# Altium schematic sheet main.SchDoc
size D; Organization: Altium Limited; Address1: 3 Minna Close; Address2: Belrose; Address3: NSW 2085; Address4: Australia
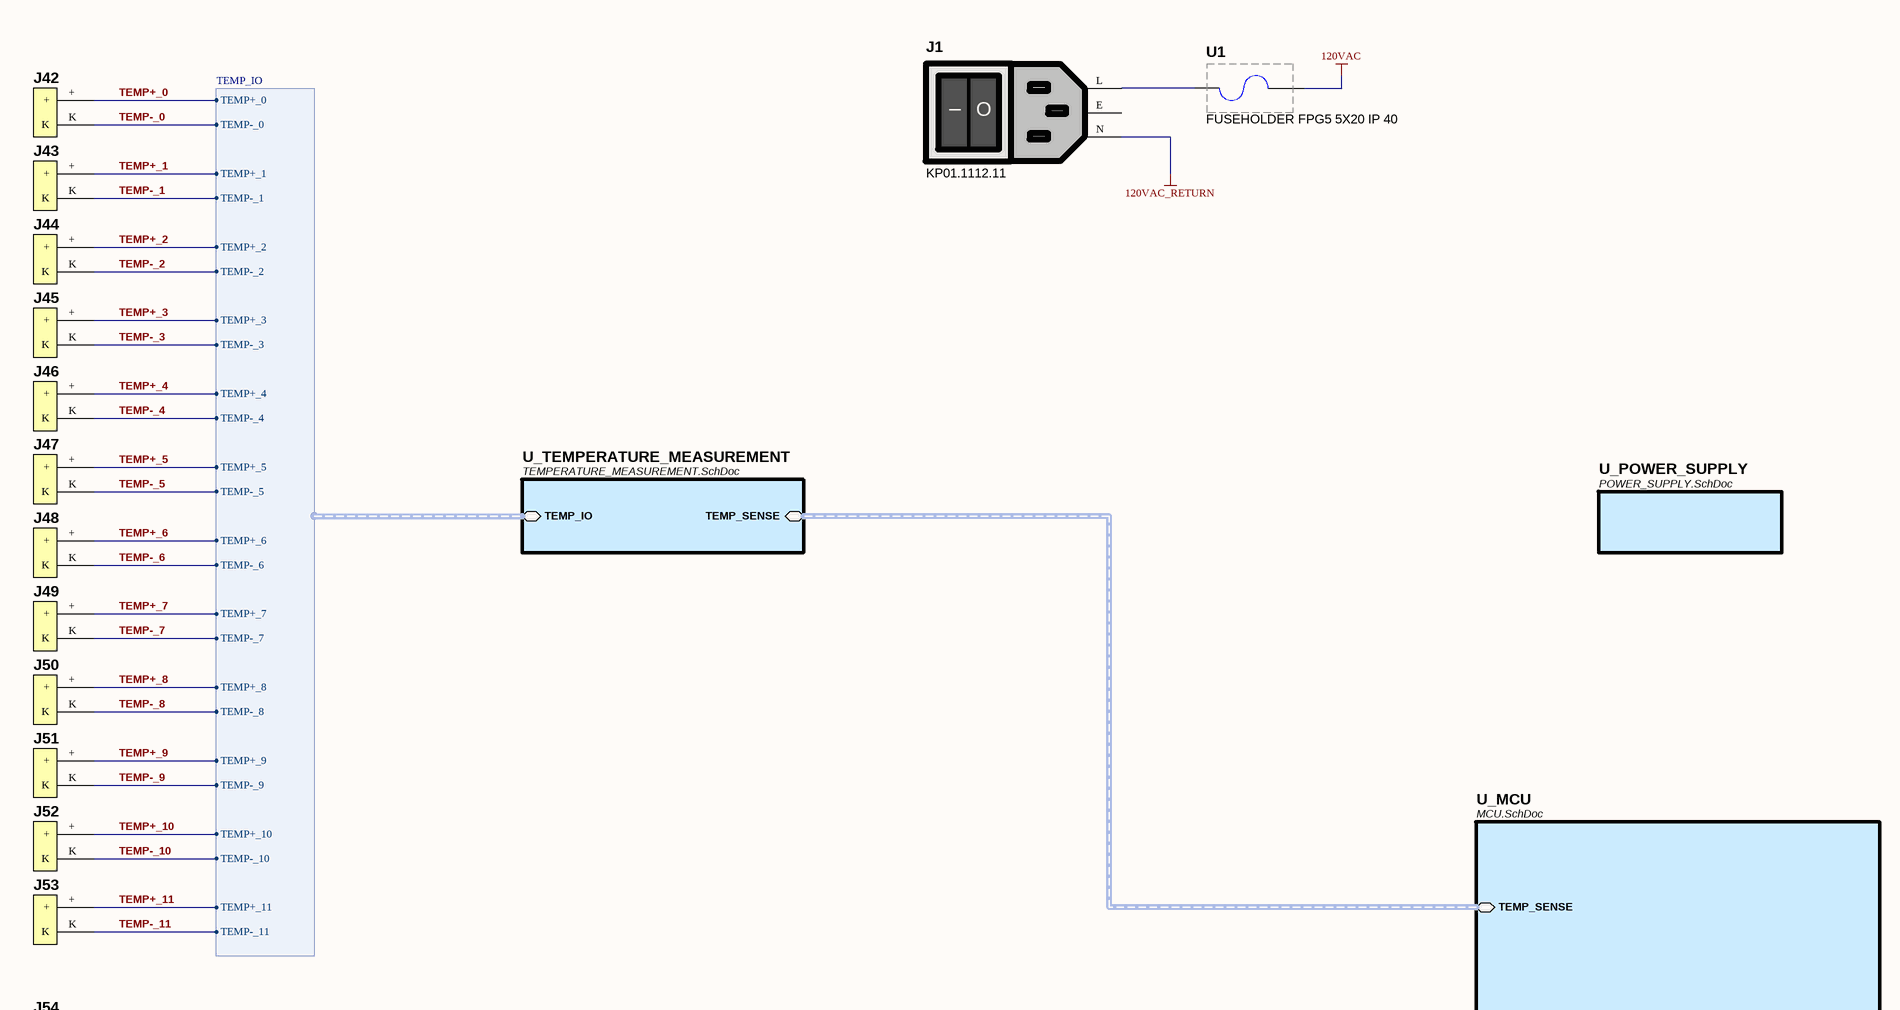
[diagram p0: main.SchDoc, top left]
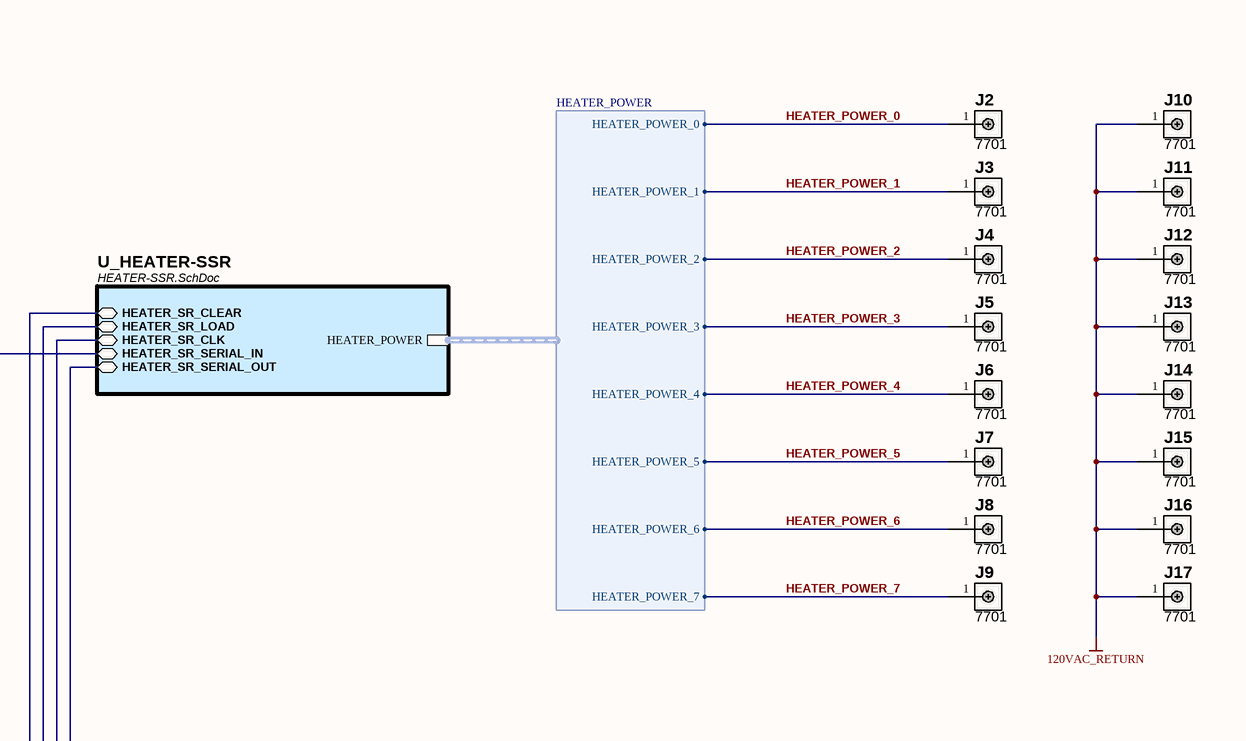
[diagram p1: main.SchDoc, top right]
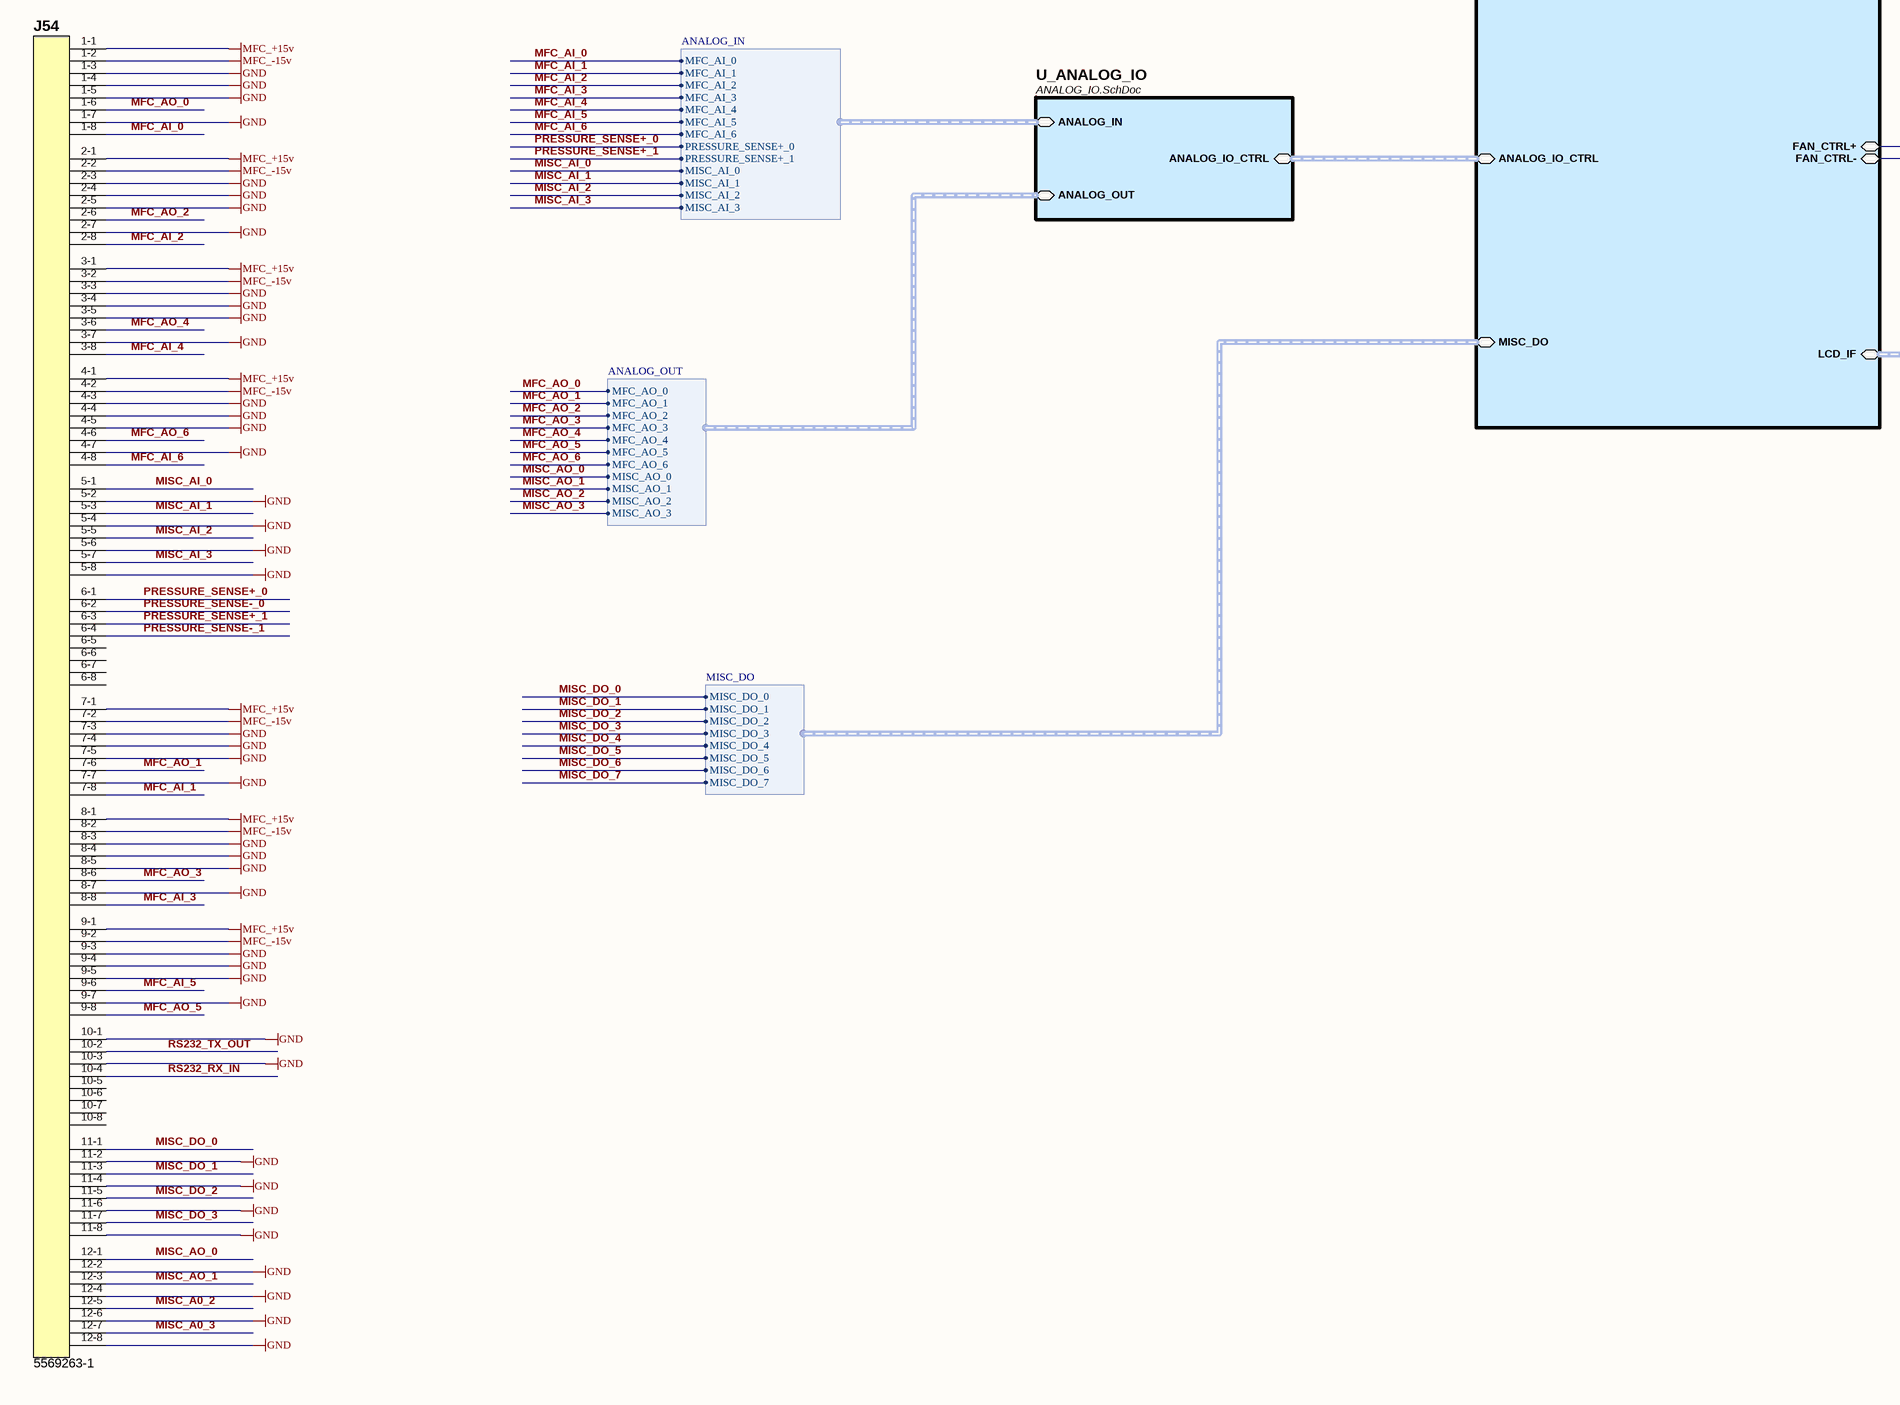
[diagram p2: main.SchDoc, bottom left]
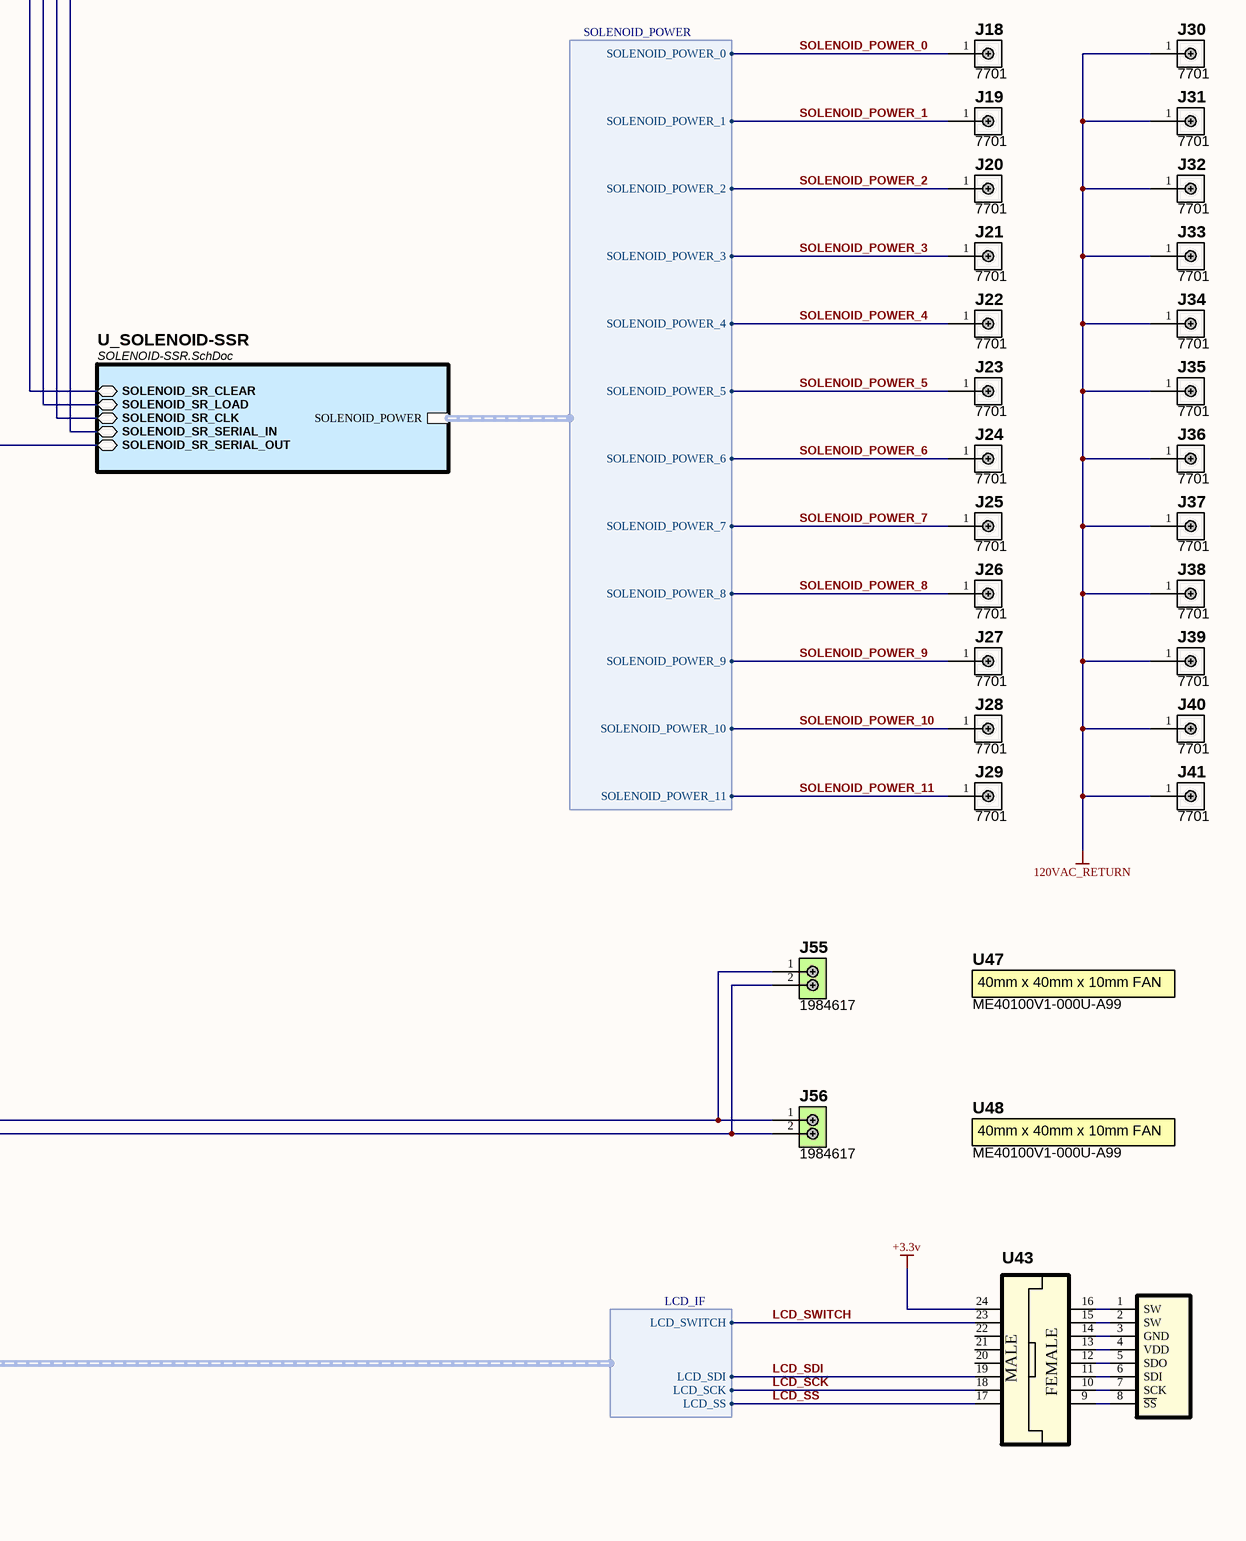
[diagram p3: main.SchDoc, bottom right]

## Parts
J1  KP01.1112.11  [KP01.1112.11]
J2  7701  [7701]
J3  7701  [7701]
J4  7701  [7701]
J5  7701  [7701]
J6  7701  [7701]
J7  7701  [7701]
J8  7701  [7701]
J9  7701  [7701]
J10  7701  [7701]
J11  7701  [7701]
J12  7701  [7701]
J13  7701  [7701]
J14  7701  [7701]
J15  7701  [7701]
J16  7701  [7701]
J17  7701  [7701]
J18  7701  [7701]
J19  7701  [7701]
J20  7701  [7701]
J21  7701  [7701]
J22  7701  [7701]
J23  7701  [7701]
J24  7701  [7701]
J25  7701  [7701]
J26  7701  [7701]
J27  7701  [7701]
J28  7701  [7701]
J29  7701  [7701]
J30  7701  [7701]
J31  7701  [7701]
J32  7701  [7701]
J33  7701  [7701]
J34  7701  [7701]
J35  7701  [7701]
J36  7701  [7701]
J37  7701  [7701]
J38  7701  [7701]
J39  7701  [7701]
J40  7701  [7701]
J41  7701  [7701]
J42  PCC-SMP-K  [PCC-SMP-V]  (value not drawn)
J43  PCC-SMP-K  [PCC-SMP-V]  (value not drawn)
J44  PCC-SMP-K  [PCC-SMP-V]  (value not drawn)
J45  PCC-SMP-K  [PCC-SMP-V]  (value not drawn)
J46  PCC-SMP-K  [PCC-SMP-V]  (value not drawn)
J47  PCC-SMP-K  [PCC-SMP-V]  (value not drawn)
J48  PCC-SMP-K  [PCC-SMP-V]  (value not drawn)
J49  PCC-SMP-K  [PCC-SMP-V]  (value not drawn)
J50  PCC-SMP-K  [PCC-SMP-V]  (value not drawn)
J51  PCC-SMP-K  [PCC-SMP-V]  (value not drawn)
J52  PCC-SMP-K  [PCC-SMP-V]  (value not drawn)
J53  PCC-SMP-K  [PCC-SMP-V]  (value not drawn)
J54  5569263-1  [5569263-1]
J55  1984617  [1984617]
J56  1984617  [1984617]
U1  FUSEHOLDER FPG5 5X20 IP 40  [3101.0055]
U43  IS15DSBFP4RGB  [R/A IS15DSBFP4RGB]  (value not drawn)
U47  ME40100V1-000U-A99  [ME40100V1-000U-A99]
U48  ME40100V1-000U-A99  [ME40100V1-000U-A99]

## Sub-sheets
U_ANALOG_IO = ANALOG_IO.SchDoc: ANALOG_IN (harness ANALOG_IN), ANALOG_OUT (harness ANALOG_OUT), ANALOG_IO_CTRL (harness ANALOG_IO_CTRL)
U_HEATER-SSR = HEATER-SSR.SchDoc: HEATER_POWER (harness HEATER_POWER), HEATER_SR_CLEAR, HEATER_SR_LOAD, HEATER_SR_CLK, HEATER_SR_SERIAL_IN, HEATER_SR_SERIAL_OUT
U_MCU = MCU.SchDoc: ANALOG_IO_CTRL (harness ANALOG_IO_CTRL), TEMP_SENSE (harness TEMP_SENSE), LCD_IF (harness LCD_IF), FAN_CTRL+, FAN_CTRL-, MISC_DO (harness MISC_DO)
U_POWER_SUPPLY = POWER_SUPPLY.SchDoc: no entries
U_SOLENOID-SSR = SOLENOID-SSR.SchDoc: SOLENOID_POWER (harness SOLENOID_POWER), SOLENOID_SR_CLEAR, SOLENOID_SR_LOAD, SOLENOID_SR_CLK, SOLENOID_SR_SERIAL_IN, SOLENOID_SR_SERIAL_OUT
U_TEMPERATURE_MEASUREMENT = TEMPERATURE_MEASUREMENT.SchDoc: TEMP_IO (harness TEMP_IO), TEMP_SENSE (harness TEMP_SENSE)

## Harnesses
HEATER_POWER: HEATER_POWER_0, HEATER_POWER_1, HEATER_POWER_2, HEATER_POWER_3, HEATER_POWER_4, HEATER_POWER_5, HEATER_POWER_6, HEATER_POWER_7
SOLENOID_POWER: SOLENOID_POWER_0, SOLENOID_POWER_1, SOLENOID_POWER_2, SOLENOID_POWER_3, SOLENOID_POWER_4, SOLENOID_POWER_5, SOLENOID_POWER_6, SOLENOID_POWER_7, SOLENOID_POWER_8, SOLENOID_POWER_9, SOLENOID_POWER_10, SOLENOID_POWER_11
TEMP_IO: TEMP-_0, TEMP+_0, TEMP+_1, TEMP-_1, TEMP+_2, TEMP-_2, TEMP+_3, TEMP-_3, TEMP+_4, TEMP-_4, TEMP+_5, TEMP-_5, TEMP+_6, TEMP-_6, TEMP+_7, TEMP-_7, TEMP+_8, TEMP-_8, TEMP+_9, TEMP-_9, TEMP+_10, TEMP-_10, TEMP+_11, TEMP-_11
ANALOG_OUT: MFC_AO_0, MFC_AO_1, MFC_AO_2, MFC_AO_3, MFC_AO_4, MFC_AO_5, MFC_AO_6, MISC_AO_0, MISC_AO_1, MISC_AO_2, MISC_AO_3
ANALOG_IN: MFC_AI_0, MFC_AI_1, MFC_AI_2, MFC_AI_3, MFC_AI_4, MFC_AI_5, MFC_AI_6, PRESSURE_SENSE+_0, PRESSURE_SENSE+_1, MISC_AI_0, MISC_AI_1, MISC_AI_2, MISC_AI_3
LCD_IF: LCD_SWITCH, LCD_SDI, LCD_SCK, LCD_SS
MISC_DO: MISC_DO_0, MISC_DO_1, MISC_DO_2, MISC_DO_3, MISC_DO_4, MISC_DO_5, MISC_DO_6, MISC_DO_7

## Nets
120VAC: U1.2
120VAC_RETURN: J1.N J10.1 J11.1 J12.1 J13.1 J14.1 J15.1 J16.1 J17.1 J30.1 J31.1 J32.1 J33.1 J34.1 J35.1 J36.1 J37.1 J38.1 J39.1 J40.1 J41.1
+3.3v: U43.24
GND: J54.1-3 J54.1-4 J54.1-5 J54.1-7 J54.2-3 J54.2-4 J54.2-5 J54.2-7 J54.3-3 J54.3-4 J54.3-5 J54.3-7 J54.4-3 J54.4-4 J54.4-5 J54.4-7 J54.5-2 J54.5-4 J54.5-6 J54.5-8 J54.7-3 J54.7-4 J54.7-5 J54.7-7 J54.8-3 J54.8-4 J54.8-5 J54.8-7 J54.9-3 J54.9-4 J54.9-5 J54.9-7 J54.10-1 J54.10-3 J54.11-2 J54.11-4 J54.11-6 J54.11-8 J54.12-2 J54.12-4 J54.12-6 J54.12-8
MFC_+15v: J54.1-1 J54.2-1 J54.3-1 J54.4-1 J54.7-1 J54.8-1 J54.9-1
MFC_-15v: J54.1-2 J54.2-2 J54.3-2 J54.4-2 J54.7-2 J54.8-2 J54.9-2
HEATER_POWER_0: J2.1 ; sheet U_HEATER-SSR/HEATER_POWER.HEATER_POWER_0
HEATER_POWER_1: J3.1 ; sheet U_HEATER-SSR/HEATER_POWER.HEATER_POWER_1
HEATER_POWER_2: J4.1 ; sheet U_HEATER-SSR/HEATER_POWER.HEATER_POWER_2
HEATER_POWER_3: J5.1 ; sheet U_HEATER-SSR/HEATER_POWER.HEATER_POWER_3
HEATER_POWER_4: J6.1 ; sheet U_HEATER-SSR/HEATER_POWER.HEATER_POWER_4
HEATER_POWER_5: J7.1 ; sheet U_HEATER-SSR/HEATER_POWER.HEATER_POWER_5
HEATER_POWER_6: J8.1 ; sheet U_HEATER-SSR/HEATER_POWER.HEATER_POWER_6
HEATER_POWER_7: J9.1 ; sheet U_HEATER-SSR/HEATER_POWER.HEATER_POWER_7
LCD_SCK: U43.18 ; sheet U_MCU/LCD_IF.LCD_SCK
LCD_SDI: U43.19 ; sheet U_MCU/LCD_IF.LCD_SDI
LCD_SS: U43.17 ; sheet U_MCU/LCD_IF.LCD_SS
LCD_SWITCH: U43.23 ; sheet U_MCU/LCD_IF.LCD_SWITCH
MFC_AI_0: J54.1-8 ; sheet U_ANALOG_IO/ANALOG_IN.MFC_AI_0
MFC_AI_1: J54.7-8 ; sheet U_ANALOG_IO/ANALOG_IN.MFC_AI_1
MFC_AI_2: J54.2-8 ; sheet U_ANALOG_IO/ANALOG_IN.MFC_AI_2
MFC_AI_3: J54.8-8 ; sheet U_ANALOG_IO/ANALOG_IN.MFC_AI_3
MFC_AI_4: J54.3-8 ; sheet U_ANALOG_IO/ANALOG_IN.MFC_AI_4
MFC_AI_5: J54.9-6 ; sheet U_ANALOG_IO/ANALOG_IN.MFC_AI_5
MFC_AI_6: J54.4-8 ; sheet U_ANALOG_IO/ANALOG_IN.MFC_AI_6
MFC_AO_0: J54.1-6 ; sheet U_ANALOG_IO/ANALOG_OUT.MFC_AO_0
MFC_AO_1: J54.7-6 ; sheet U_ANALOG_IO/ANALOG_OUT.MFC_AO_1
MFC_AO_2: J54.2-6 ; sheet U_ANALOG_IO/ANALOG_OUT.MFC_AO_2
MFC_AO_3: J54.8-6 ; sheet U_ANALOG_IO/ANALOG_OUT.MFC_AO_3
MFC_AO_4: J54.3-6 ; sheet U_ANALOG_IO/ANALOG_OUT.MFC_AO_4
MFC_AO_5: J54.9-8 ; sheet U_ANALOG_IO/ANALOG_OUT.MFC_AO_5
MFC_AO_6: J54.4-6 ; sheet U_ANALOG_IO/ANALOG_OUT.MFC_AO_6
MISC_A0_2: J54.12-5
MISC_A0_3: J54.12-7
MISC_AI_0: J54.5-1 ; sheet U_ANALOG_IO/ANALOG_IN.MISC_AI_0
MISC_AI_1: J54.5-3 ; sheet U_ANALOG_IO/ANALOG_IN.MISC_AI_1
MISC_AI_2: J54.5-5 ; sheet U_ANALOG_IO/ANALOG_IN.MISC_AI_2
MISC_AI_3: J54.5-7 ; sheet U_ANALOG_IO/ANALOG_IN.MISC_AI_3
MISC_AO_0: J54.12-1 ; sheet U_ANALOG_IO/ANALOG_OUT.MISC_AO_0
MISC_AO_1: J54.12-3 ; sheet U_ANALOG_IO/ANALOG_OUT.MISC_AO_1
MISC_AO_2: sheet U_ANALOG_IO/ANALOG_OUT.MISC_AO_2
MISC_AO_3: sheet U_ANALOG_IO/ANALOG_OUT.MISC_AO_3
MISC_DO_0: J54.11-1 ; sheet U_MCU/MISC_DO.MISC_DO_0
MISC_DO_1: J54.11-3 ; sheet U_MCU/MISC_DO.MISC_DO_1
MISC_DO_2: J54.11-5 ; sheet U_MCU/MISC_DO.MISC_DO_2
MISC_DO_3: J54.11-7 ; sheet U_MCU/MISC_DO.MISC_DO_3
MISC_DO_4: sheet U_MCU/MISC_DO.MISC_DO_4
MISC_DO_5: sheet U_MCU/MISC_DO.MISC_DO_5
MISC_DO_6: sheet U_MCU/MISC_DO.MISC_DO_6
MISC_DO_7: sheet U_MCU/MISC_DO.MISC_DO_7
PRESSURE_SENSE+_0: J54.6-1 ; sheet U_ANALOG_IO/ANALOG_IN.PRESSURE_SENSE+_0
PRESSURE_SENSE+_1: J54.6-3 ; sheet U_ANALOG_IO/ANALOG_IN.PRESSURE_SENSE+_1
PRESSURE_SENSE-_0: J54.6-2
PRESSURE_SENSE-_1: J54.6-4
RS232_RX_IN: J54.10-4
RS232_TX_OUT: J54.10-2
SOLENOID_POWER_0: J18.1 ; sheet U_SOLENOID-SSR/SOLENOID_POWER.SOLENOID_POWER_0
SOLENOID_POWER_1: J19.1 ; sheet U_SOLENOID-SSR/SOLENOID_POWER.SOLENOID_POWER_1
SOLENOID_POWER_2: J20.1 ; sheet U_SOLENOID-SSR/SOLENOID_POWER.SOLENOID_POWER_2
SOLENOID_POWER_3: J21.1 ; sheet U_SOLENOID-SSR/SOLENOID_POWER.SOLENOID_POWER_3
SOLENOID_POWER_4: J22.1 ; sheet U_SOLENOID-SSR/SOLENOID_POWER.SOLENOID_POWER_4
SOLENOID_POWER_5: J23.1 ; sheet U_SOLENOID-SSR/SOLENOID_POWER.SOLENOID_POWER_5
SOLENOID_POWER_6: J24.1 ; sheet U_SOLENOID-SSR/SOLENOID_POWER.SOLENOID_POWER_6
SOLENOID_POWER_7: J25.1 ; sheet U_SOLENOID-SSR/SOLENOID_POWER.SOLENOID_POWER_7
SOLENOID_POWER_8: J26.1 ; sheet U_SOLENOID-SSR/SOLENOID_POWER.SOLENOID_POWER_8
SOLENOID_POWER_9: J27.1 ; sheet U_SOLENOID-SSR/SOLENOID_POWER.SOLENOID_POWER_9
SOLENOID_POWER_10: J28.1 ; sheet U_SOLENOID-SSR/SOLENOID_POWER.SOLENOID_POWER_10
SOLENOID_POWER_11: J29.1 ; sheet U_SOLENOID-SSR/SOLENOID_POWER.SOLENOID_POWER_11
TEMP+_0: J42.+ ; sheet U_TEMPERATURE_MEASUREMENT/TEMP_IO.TEMP+_0
TEMP+_1: J43.+ ; sheet U_TEMPERATURE_MEASUREMENT/TEMP_IO.TEMP+_1
TEMP+_2: J44.+ ; sheet U_TEMPERATURE_MEASUREMENT/TEMP_IO.TEMP+_2
TEMP+_3: J45.+ ; sheet U_TEMPERATURE_MEASUREMENT/TEMP_IO.TEMP+_3
TEMP+_4: J46.+ ; sheet U_TEMPERATURE_MEASUREMENT/TEMP_IO.TEMP+_4
TEMP+_5: J47.+ ; sheet U_TEMPERATURE_MEASUREMENT/TEMP_IO.TEMP+_5
TEMP+_6: J48.+ ; sheet U_TEMPERATURE_MEASUREMENT/TEMP_IO.TEMP+_6
TEMP+_7: J49.+ ; sheet U_TEMPERATURE_MEASUREMENT/TEMP_IO.TEMP+_7
TEMP+_8: J50.+ ; sheet U_TEMPERATURE_MEASUREMENT/TEMP_IO.TEMP+_8
TEMP+_9: J51.+ ; sheet U_TEMPERATURE_MEASUREMENT/TEMP_IO.TEMP+_9
TEMP+_10: J52.+ ; sheet U_TEMPERATURE_MEASUREMENT/TEMP_IO.TEMP+_10
TEMP+_11: J53.+ ; sheet U_TEMPERATURE_MEASUREMENT/TEMP_IO.TEMP+_11
TEMP-_0: J42.K ; sheet U_TEMPERATURE_MEASUREMENT/TEMP_IO.TEMP-_0
TEMP-_1: J43.K ; sheet U_TEMPERATURE_MEASUREMENT/TEMP_IO.TEMP-_1
TEMP-_2: J44.K ; sheet U_TEMPERATURE_MEASUREMENT/TEMP_IO.TEMP-_2
TEMP-_3: J45.K ; sheet U_TEMPERATURE_MEASUREMENT/TEMP_IO.TEMP-_3
TEMP-_4: J46.K ; sheet U_TEMPERATURE_MEASUREMENT/TEMP_IO.TEMP-_4
TEMP-_5: J47.K ; sheet U_TEMPERATURE_MEASUREMENT/TEMP_IO.TEMP-_5
TEMP-_6: J48.K ; sheet U_TEMPERATURE_MEASUREMENT/TEMP_IO.TEMP-_6
TEMP-_7: J49.K ; sheet U_TEMPERATURE_MEASUREMENT/TEMP_IO.TEMP-_7
TEMP-_8: J50.K ; sheet U_TEMPERATURE_MEASUREMENT/TEMP_IO.TEMP-_8
TEMP-_9: J51.K ; sheet U_TEMPERATURE_MEASUREMENT/TEMP_IO.TEMP-_9
TEMP-_10: J52.K ; sheet U_TEMPERATURE_MEASUREMENT/TEMP_IO.TEMP-_10
TEMP-_11: J53.K ; sheet U_TEMPERATURE_MEASUREMENT/TEMP_IO.TEMP-_11
NetJ1_L: J1.L U1.1
NetJ55_1: J55.1 J56.1 ; sheet U_MCU/FAN_CTRL+
NetJ55_2: J55.2 J56.2 ; sheet U_MCU/FAN_CTRL-
NetU43_1: U43.1(SW) U43.16
NetU43_2: U43.2(SW) U43.15
NetU43_3: U43.3(GND) U43.14
NetU43_4: U43.4(VDD) U43.13
NetU43_5: U43.5(SDO) U43.12
NetU43_6: U43.6(SDI) U43.11
NetU43_7: U43.7(SCK) U43.10
NetU43_8: U43.8(~{SS}) U43.9
(unnamed): sheet U_HEATER-SSR/HEATER_SR_CLEAR, sheet U_SOLENOID-SSR/SOLENOID_SR_CLEAR
(unnamed): sheet U_HEATER-SSR/HEATER_SR_LOAD, sheet U_SOLENOID-SSR/SOLENOID_SR_LOAD
(unnamed): sheet U_HEATER-SSR/HEATER_SR_CLK, sheet U_SOLENOID-SSR/SOLENOID_SR_CLK
(unnamed): sheet U_HEATER-SSR/HEATER_SR_SERIAL_OUT, sheet U_SOLENOID-SSR/SOLENOID_SR_SERIAL_IN

Not connected (* = marked no-connect by the designer): J1 E(G); J54 6-5 6-6 6-7 6-8 10-5 10-6 10-7 10-8; U43 20 21 22

## Buses and harness runs
harness sheet U_ANALOG_IO/ANALOG_IO_CTRL = sheet U_MCU/ANALOG_IO_CTRL
harness sheet U_MCU/TEMP_SENSE = sheet U_TEMPERATURE_MEASUREMENT/TEMP_SENSE

## Notes on the sheet
- -1
- 2
- Wavenumber
- Technologies
- pl
- Rev:
- Sheet
- of
- (in symbol KP01.1112.11) _; O
- (in symbol ME40100V1-000U-A99) 40mm x 40mm x 10mm FAN
- (in symbol R/A IS15DSBFP4RGB) MALE; FEMALE

## Library data of the parts
J1 = KP01.1112.11: AC Power Entry Modules SNAP-N PCB 2-POLE; Manufacturer: Schurter; Connector Type: IEC-320 C-14; Current Rating: 10 A; Filtered: No; Switch Function: Switched; Voltage Rating: 250 V; Value: KP01.1112.11; Supplier 1: Mouser; Supplier Part Number 1: 693-KP01.1112.11; Manufacturer Part Number: KP01.1112.11; RoHS: RoHS Compliant; Category: AC Power Entry Modules; Stock 1: 316; Pricing 1: 1=15.82, 25=14.04, 50=12.65, 100=11.93, 200=10.48 (AUD); Fused: No; Housing Material: Thermoplastic; Operating Temperature Range: - 25 C to + 70 C; Product: Inlets; Series: KP; Termination Style: Quick Connect; Flammability Rating: UL 94 V-0; Mounting Style: Snap In; Product Category: Power Entry Modules; Standard Pack Qty: 50; RoHS - Mouser: Y; Minimum Order Quantity: 1; Reeling: False; ComponentLink1URL: http://www.schurterinc.com/pdf/english/typ_kp__switch_.pdf; ComponentLink1Description: http://www.schurterinc.com/pdf/english/typ_kp__switch_.pdf
J2-J41 = 7701: TERM W/ASSEMBLD SCREW VERT PCMNT; Manufacturer: Keystone Electronics; Screw Size: 6-32; Current Rating: 15A; Number of Legs: 4; Screw Material: Brass; Screw Finish: Nickel; Supplier 1: Digi-Key; Supplier Part Number 1: 7701K-ND; Manufacturer Part Number: 7701; RoHS: RoHS Compliant; Category: Connectors, Interconnects; Stock 1: 77817; Pricing 1: 1=0.49, 10=0.462, 50=0.449, 100=0.354, 250=0.32324, 500=0.30784, 1000=0.256, 2500=0.23088, 5000=0.22318 (USD); Terminal Type: Screw Terminal, Power Tap; Termination: Solder; Mounting Type: Through Hole; Features: -; Contact Finish: Tin; Contact Material: Brass; Material - Insulation: -; ComponentLink1URL: http://www.keyelco.com/product-pdf.cfm?p=1081; ComponentLink1Description: http://www.keyelco.com/product-pdf.cfm?p=1081; Value: 7701
J42-J53 = PCC-SMP-K-100: Vertical K type thermocouple connector - K; Manufacturer: Omega; Manufacturer Part Number]: PCC-SMP-K-100; Supplier 1: Omega; Supplier 1 Part Number: PCC-SMP-K-100; Value: PCC-SMP-K
J54 = 5569263-1: CONN MOD JACK R/A 8P8C SHIELDED; Manufacturer: TE Connectivity; Number of Positions/Contacts: 8p8c (RJ45, Ethernet); Number of Ports: 12; Shielding: Shielded, EMI Finger; Ratings: Cat5; LED Color: Does Not Contain LED; Tab Direction: Up and Down; Value: 5569263-1; Supplier 1: Digi-Key; Supplier Part Number 1: A31480-ND; Manufacturer Part Number: 5569263-1; RoHS: RoHS Compliant; Category: Connectors, Interconnects; Stock 1: 503; Pricing 1: 1=21.11, 10=19.055, 50=17.115, 100=16.5445, 250=15.63172, 500=15.1753, 1000=14.833 (USD); Packaging: Bulk; Connector Type: Jack; Number of Rows: 2; Mounting Type: Through Hole; Orientation: 90° Angle (Right); Termination: Solder; Features: Board Guide; Ingress Protection: -; Contact Material: Phosphor Bronze; Contact Finish: Gold; Contact Finish Thickness: 50µin (1.27µm); Housing Material: Polycyclohexylenedimethylene Terephthalate (PCT), Polyester; Operating Temperature: -40°C ~ 85°C; ComponentLink1URL: http://www.te.com/commerce/DocumentDelivery/DDEController?Action=srchrtrv&DocNm=5569263&DocType=Customer+Drawing&DocLang=English; ComponentLink1Description: http://www.te.com/commerce/DocumentDelivery/DDEController?Action=srchrtrv&DocNm=5569263&DocType=Customer+Drawing&DocLang=English
J55 J56 = 1984617: CONN TERM BLOCK T/H 2POS 3.5MM; Manufacturer: Phoenix Contact; Number of Levels: 1; Positions Per Level: 2; Pitch: 0.138" (3.50mm); Mating Orientation: Horizontal with Board; Current: 10A; Voltage: 300V; Wire Gauge: 16-26 AWG; Wire Termination: Screw - Rising Cage Clamp; Torque - Screw: 0.22-0.25 Nm (1.9-2.2 Lb-In); Screw Thread: M2; Supplier 1: Digi-Key; Supplier Part Number 1: 277-1721-ND; Manufacturer Part Number: 1984617; RoHS: RoHS Compliant; Category: Connectors, Interconnects; Stock 1: 10915; Pricing 1: 1=0.34, 10=0.322, 50=0.308, 100=0.2996, 250=0.28, 500=0.2576, 1000=0.238 (USD); Mounting Type: Through Hole; Features: Interlocking (Side); Color: Green; Packaging: Bulk; Operating Temperature: -; Housing Material: Polyamide (PA), Nylon; Contact Material - Plating: -; Clamp Material - Plating: -; Screw Material - Plating: -; ComponentLink1URL: http://media.digikey.com/pdf/Data%20Sheets/Phoenix%20Contact%20PDFs/1984617.pdf; ComponentLink1Description: http://media.digikey.com/pdf/Data%20Sheets/Phoenix%20Contact%20PDFs/1984617.pdf; Value: 1984617
U1 = 3101.0055: Manufacturer: Schurter Inc; Fuse Size: 5mm x 20mm; Number of Circuits: 1; Voltage: 250V; Current Rating: 16A; Value: FUSEHOLDER FPG5 5X20 IP 40; Supplier 1: Digi-Key; Supplier Part Number 1: 486-2056-ND; Manufacturer Part Number: 3101.0055; RoHS: RoHS Compliant; Category: Circuit Protection; Stock 1: 125; Pricing 1: 1=3.07, 25=2.454, 50=2.2086, 100=2.0859, 250=1.84052, 500=1.63192 (USD); Type: Holder; Mounting Type: PCB, Horizontal; Termination Style: PC Pin; Material: Copper Alloy, Tin Plated; ComponentLink1URL: http://www.schurterinc.com/var/schurter/storage/ilcatalogue/files/document/datasheet/en/pdf/typ_FPG5.pdf; ComponentLink1Description: http://www.schurterinc.com/var/schurter/storage/ilcatalogue/files/document/datasheet/en/pdf/typ_FPG5.pdf
U43 = R/A IS15DSBFP4RGB: 64x32 Compact Smart Switch; Manufacturer: NKK Switches; Male Connetor: DF11-8DP-2DS(24); Supplier 1: Mouser; Supplier Part Number 1: 633-IS15DSBFP4RGB; Value: IS15DSBFP4RGB; Manufacturer Part Number: IS15DSBFP4RGB
U47 U48 = ME40100V1-000U-A99: FAN 40X10MM 5VDC 1.08W 8CFM; Manufacturer: Sunon Fans; Air Flow: 8.0 CFM (0.226m&sup3;/min); Static Pressure: 0.190 in H2O (47.3 Pa); Bearing Type: Vapo-Bearing™; Fan Type: Tubeaxial; Noise: 32 dB(A); RPM: 7000 RPM; Current Rating: 0.215A; Material - Frame: Polybutylene Terephthalate (PBT); Value: ME40100V1-000U-A99; Supplier 1: Digi-Key; Supplier Part Number 1: 259-1575-ND; Manufacturer Part Number: ME40100V1-000U-A99; RoHS: RoHS Compliant; Category: Fans, Thermal Management; Stock 1: 4525; Pricing 1: 1=4.75, 10=4.356, 25=3.96, 50=3.564, 100=3.267, 250=3.11852, 500=2.9205, 1000=2.7225 (USD); Voltage - Rated: 5VDC; Features: -; Power (Watts): 1.08W; Size / Dimension: Square - 40mm L x 40mm H x 10mm W; Termination: 2 Wire Leads; Weight: 0.03 lb (13.61g); Operating Temperature: -; Voltage Range: -; Life Expectancy: -; Material - Blade: Polybutylene Terephthalate (PBT); ComponentLink1URL: http://www.sunon.com/uFiles/file/03_products/08-catalog%20download/Sunon%20DC%20Brushless%20Fan%20&%20Blower_(190-E).pdf; ComponentLink1Description: http://www.sunon.com/uFiles/file/03_products/08-catalog%20download/Sunon%20DC%20Brushless%20Fan%20&%20Blower_(190-E).pdf